# EAGLE schematic RackBuddy (EAGLE 7.1.0)
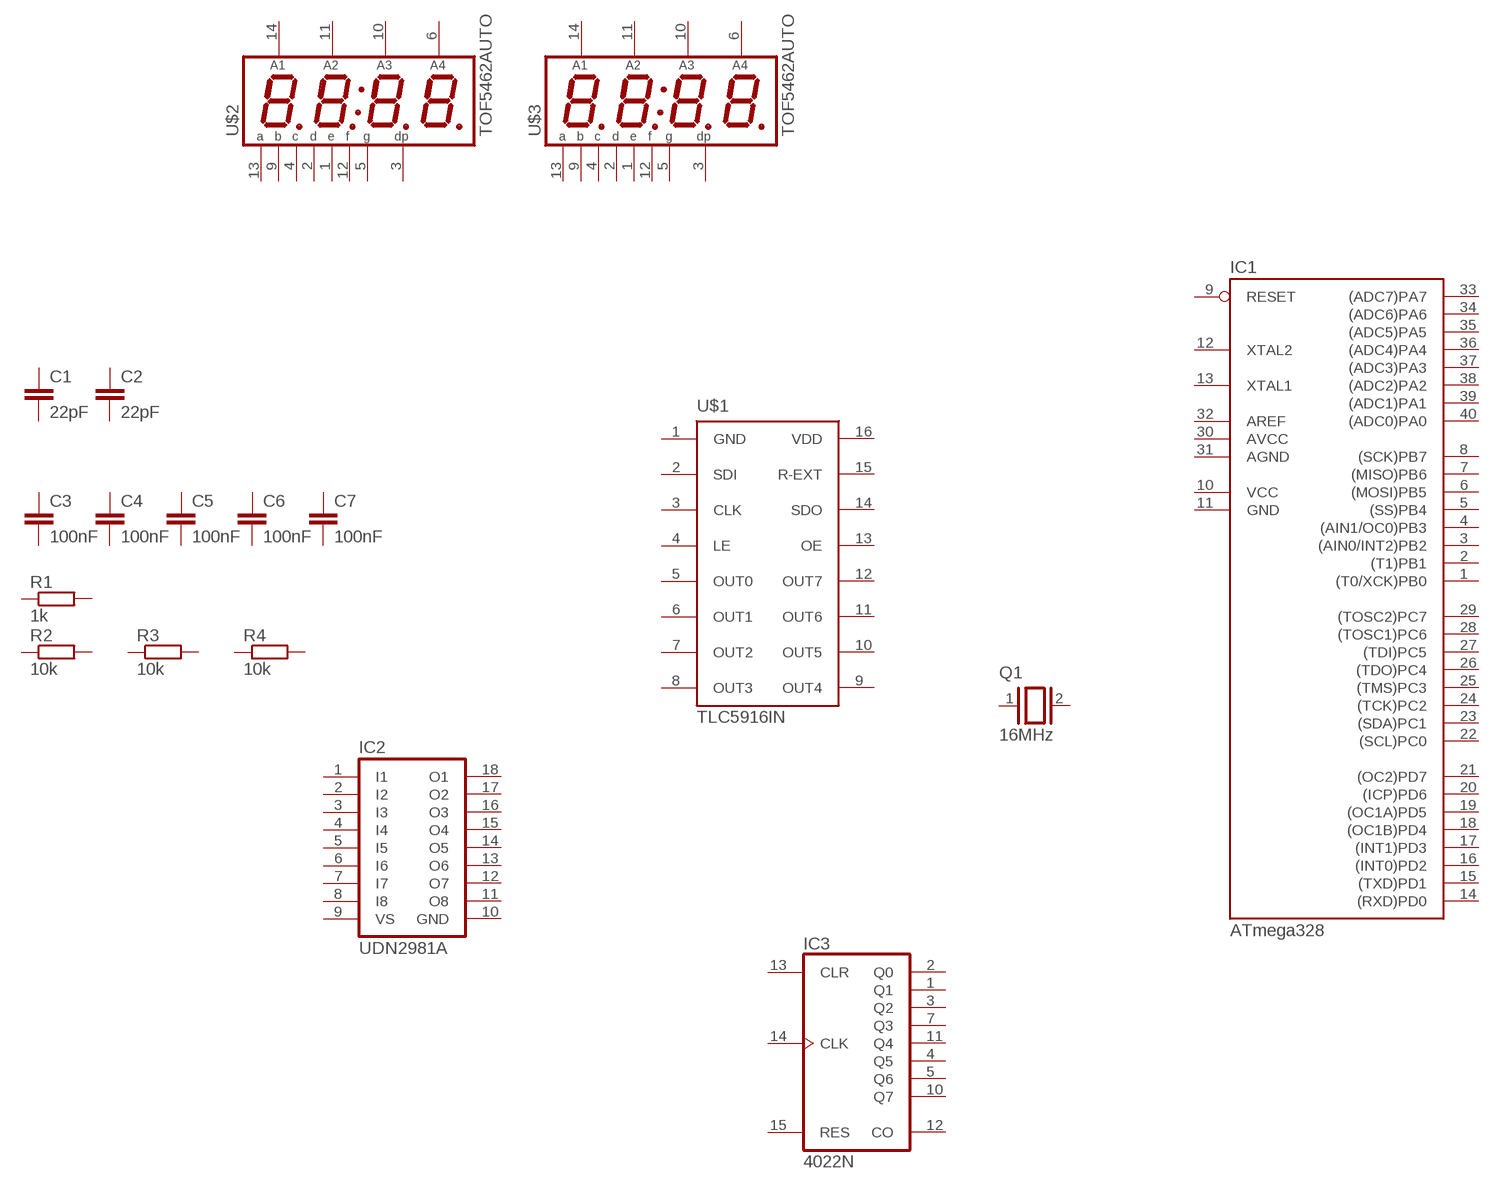
[diagram p0: schematic, sheet 1]

## Parts
C1  22pF  C-EU025-024X044  [C025-024X044]
C2  22pF  C-EU025-024X044  [C025-024X044]
C3  100nF  C-EU025-024X044  [C025-024X044]
C4  100nF  C-EU025-024X044  [C025-024X044]
C5  100nF  C-EU025-024X044  [C025-024X044]
C6  100nF  C-EU025-024X044  [C025-024X044]
C7  100nF  C-EU025-024X044  [C025-024X044]
IC1  ATmega328  MEGA32-P  [DIL40]
IC2  UDN2981A  [DIL18]
IC3  4022N  [DIL16]
Q1  16MHz  XTAL/S  [QS]
R1  1k  R-EU_0204/7  [0204/7]
R2  10k  R-EU_0204/7  [0204/7]
R3  10k  R-EU_0204/7  [0204/7]
R4  10k  R-EU_0204/7  [0204/7]
U$1  TLC5916IN  [DIL16]
U$2  TOF5462AUTO  [TOF5462]
U$3  TOF5462AUTO  [TOF5462]
Unconnected: C1.1 C1.2 C2.1 C2.2 C3.1 C3.2 C4.1 C4.2 C5.1 C5.2 C6.1 C6.2 C7.1 C7.2 IC1.1((T0/XCK)PB0) IC1.2((T1)PB1) IC1.3((AIN0/INT2)PB2) IC1.4((AIN1/OC0)PB3) IC1.5((SS)PB4) IC1.6((MOSI)PB5) IC1.7((MISO)PB6) IC1.8((SCK)PB7) IC1.9(RESET) IC1.12(XTAL2) IC1.13(XTAL1) IC1.14((RXD)PD0) IC1.15((TXD)PD1) IC1.16((INT0)PD2) IC1.17((INT1)PD3) IC1.18((OC1B)PD4) IC1.19((OC1A)PD5) IC1.20((ICP)PD6) IC1.21((OC2)PD7) IC1.22((SCL)PC0) IC1.23((SDA)PC1) IC1.24((TCK)PC2) IC1.25((TMS)PC3) IC1.26((TDO)PC4) IC1.27((TDI)PC5) IC1.28((TOSC1)PC6) IC1.29((TOSC2)PC7) IC1.33((ADC7)PA7) IC1.34((ADC6)PA6) IC1.35((ADC5)PA5) IC1.36((ADC4)PA4) IC1.37((ADC3)PA3) IC1.38((ADC2)PA2) IC1.39((ADC1)PA1) IC1.40((ADC0)PA0) IC2.1(I1) IC2.2(I2) IC2.3(I3) IC2.4(I4) IC2.5(I5) IC2.6(I6) IC2.7(I7) IC2.8(I8) IC2.9(VS) IC2.11(O8) IC2.12(O7) IC2.13(O6) IC2.14(O5) IC2.15(O4) IC2.16(O3) IC2.17(O2) IC2.18(O1) IC3.1(Q1) IC3.2(Q0) IC3.3(Q2) IC3.4(Q5) IC3.5(Q6) IC3.7(Q3) IC3.10(Q7) IC3.11(Q4) IC3.12(CO) IC3.13(CLR) IC3.14(CLK) IC3.15(RES) Q1.1 Q1.2 R1.1 R1.2 R2.1 R2.2 R3.1 R3.2 R4.1 R4.2 U$1.2(SDI) U$1.3(CLK) U$1.4(LE) U$1.5(OUT0) U$1.6(OUT1) U$1.7(OUT2) U$1.8(OUT3) U$1.9(OUT4) U$1.10(OUT5) U$1.11(OUT6) U$1.12(OUT7) U$1.13(OE) U$1.14(SDO) U$1.15(R-EXT) U$2.1(E) U$2.2(D) U$2.3(DP) U$2.4(C) U$2.5(G) U$2.6(A4) U$2.9(B) U$2.10(A3) U$2.11(A2) U$2.12(F) U$2.13(A) U$2.14(A1) U$3.1(E) U$3.2(D) U$3.3(DP) U$3.4(C) U$3.5(G) U$3.6(A4) U$3.9(B) U$3.10(A3) U$3.11(A2) U$3.12(F) U$3.13(A) U$3.14(A1)

## Power pins joined to a net without a drawn wire
AGND: IC1.31(AGND)
AREF: IC1.32(AREF)
AVCC: IC1.30(AVCC)
GND: IC1.11(GND) IC2.10(GND) U$1.1(GND)
VCC: IC1.10(VCC)
VDD: IC3.16(VDD) U$1.16(VDD)
VSS: IC3.8(VSS)

## Library data of the parts
C1-C7 = rcl:C-EU: CAPACITOR, European symbol
IC1 = avr-7:MEGA32-P: MICROCONTROLLER 32 Kbytes FLASH 2 Kbytes SRAM 1 Kbytes EEPROM USART 8-channel 10 bit ADC
IC2 = uln-udn:UDN298*: DRIVER ARRAY Source: Allegro Microsystems Inc. / UDN2981-UDN2984.pdf
IC3 = 40xx:4022: Divide-by 8 COUNTER
Q1 = special:XTAL/S: CRYSTAL
R1-R4 = rcl:R-EU_: RESISTOR, European symbol
U$1 = zlalanne:TLC5916: TLC5916 8-Channel Constant-Current LED Sink Drivers Datasheet <http://www.ti.com/lit/ds/symlink/tlc5916.pdf>
U$2 U$3 = TOF5462:TOF5462